# EAGLE design USBPOVToy.v1c (EAGLE 5.07)
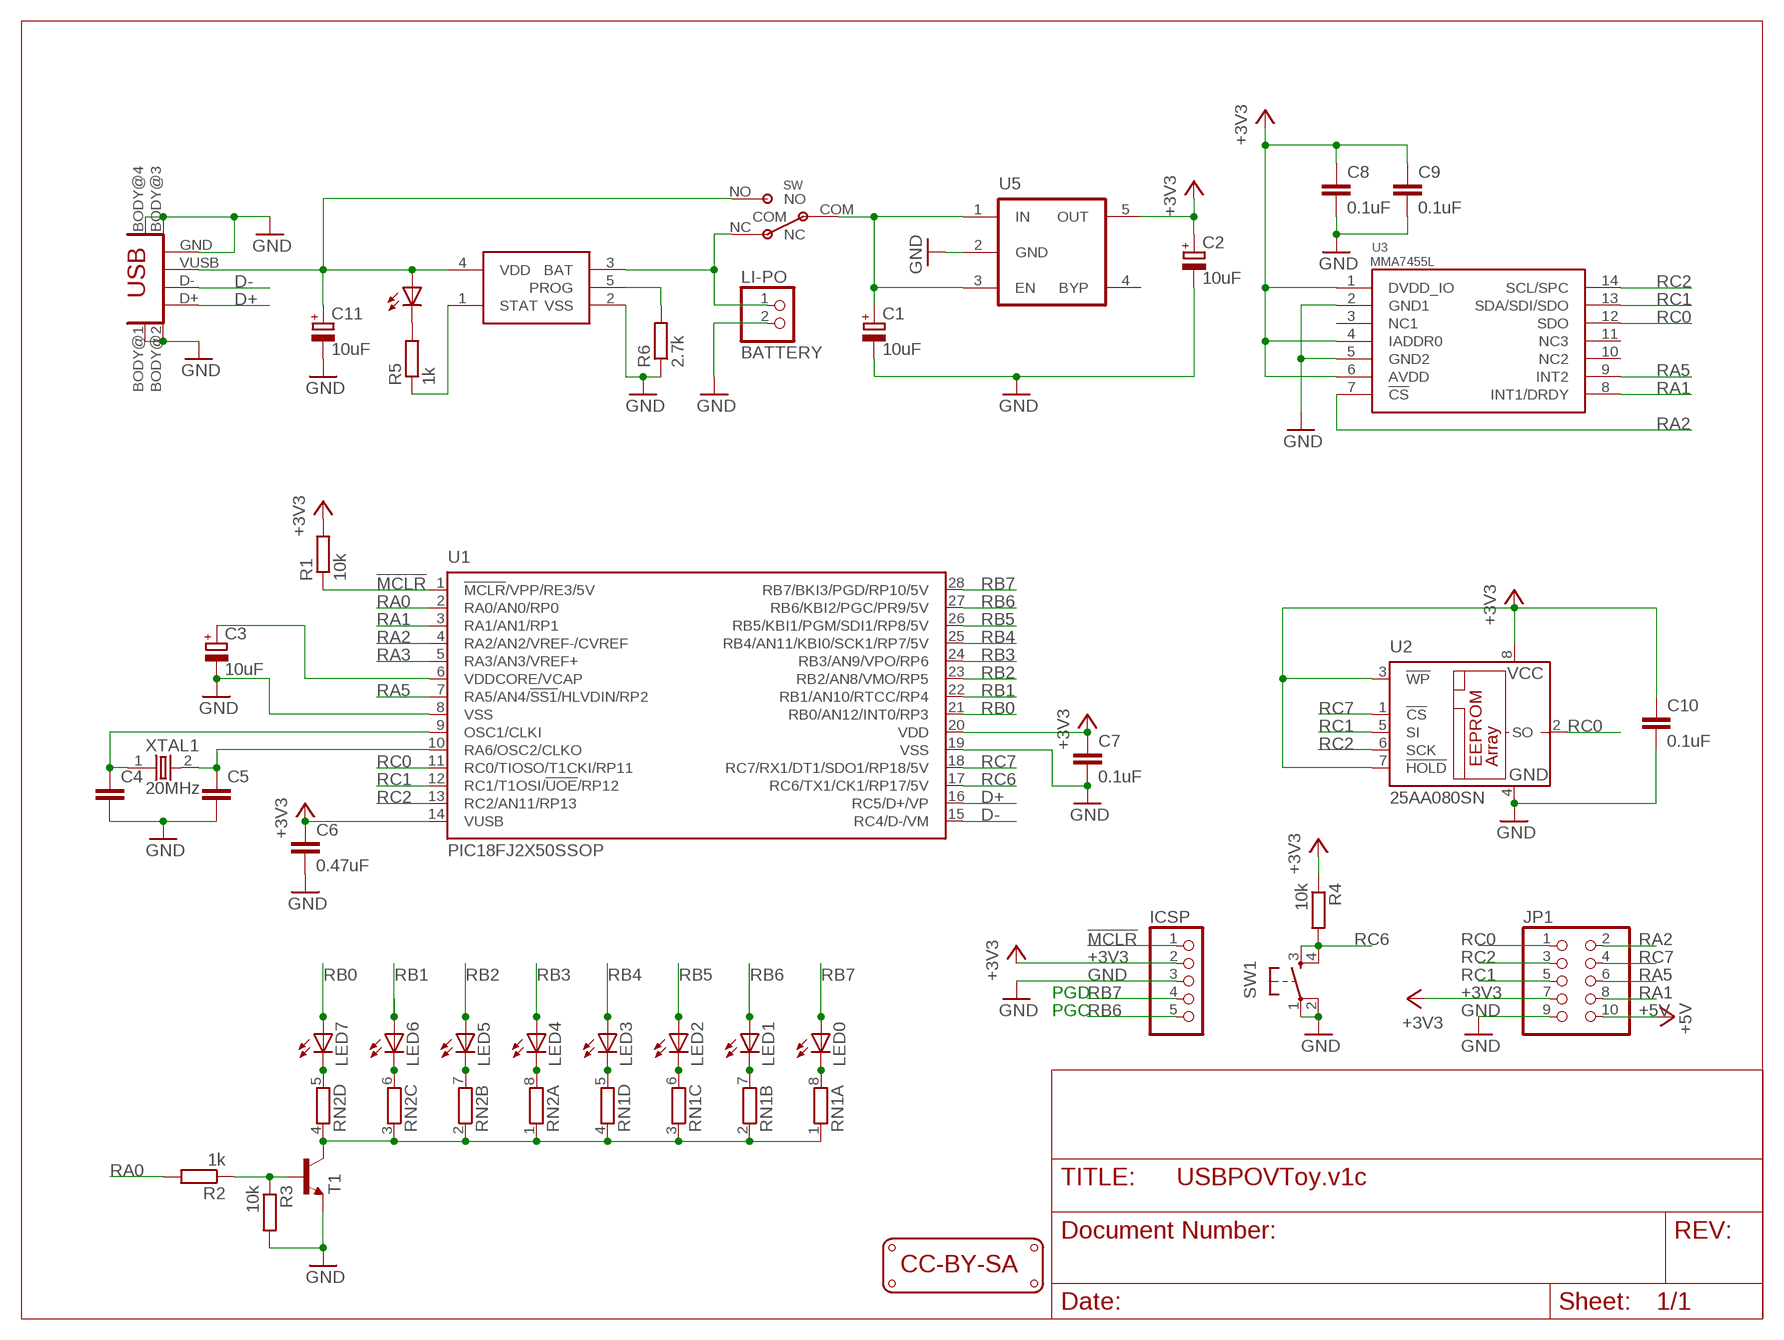
[diagram p0: schematic, sheet 1]

## Parts
C1  10uF  CAP_POLSMC_A  [SMC_A]
C2  10uF  CAP_POLSMC_A  [SMC_A]
C3  10uF  CAP_POLSMC_A  [SMC_A]
C4  CAPC603  [C603]
C5  CAPC603  [C603]
C6  0.47uF  CAPC603  [C603]
C7  0.1uF  CAPC603  [C603]
C8  0.1uF  CAPC603  [C603]
C9  0.1uF  CAPC603  [C603]
C10  0.1uF  CAPC603  [C603]
C11  10uF  CAP_POLSMC_A  [SMC_A]
CHRG  LED805  [LED-805]
ICSP  PINHD-1X5  [1X05]
JP1  PINHD-2X5  [2X05]
LED0  LED3MM  [LED-3MM]
LED1  LED3MM  [LED-3MM]
LED2  LED3MM  [LED-3MM]
LED3  LED3MM  [LED-3MM]
LED4  LED3MM  [LED-3MM]
LED5  LED3MM  [LED-3MM]
LED6  LED3MM  [LED-3MM]
LED7  LED3MM  [LED-3MM]
LED8  LED805  [LED-805]
LED9  LED805  [LED-805]
LED10  LED805  [LED-805]
LED11  LED805  [LED-805]
LED12  LED805  [LED-805]
LED13  LED805  [LED-805]
LED14  LED805  [LED-805]
LED15  LED805  [LED-805]
LI-PO  BATTERY  PINHD-1X2  [1X02]
LOGO1  LOGO_CC-BY-SA  [CC-BY-SA]
R1  10k  RESISTORR603  [R603]
R2  1k  RESISTORR603  [R603]
R3  10k  RESISTORR603  [R603]
R4  10k  RESISTORR603  [R603]
R5  1k  RESISTORR603  [R603]
R6  2.7k  RESISTORR603  [R603]
RN1  RNETWORK  [RN8P-4R-CRA06S]
RN2  RNETWORK  [RN8P-4R-CRA06S]
SW  SLIDE_SWITCH_SMD  [SLIDE_SWITCH_SMD]
SW1  SMD_TACT_SMALL  [TACT_SWITCH_SMALL]
T1  NPNSOT23BEC  [SOT23-BEC]
U1  PIC18FJ2X50SSOP  [SSOP28]
U2  25AA080SN  [SO-08]
U3  MMA7455L  [LGA-14]
U4  MCP73831  [SOT-23-5]
U5  MIC5205  [SOT-23-5]
USB  CONN_USB  [CONN_USB_MINI-B]
XTAL1  20MHz  CRYSTAL  [HC-49U]

## Nets
!MCLR: ICSP.1 R1.1 U1.1(!MCLR!/VPP/RE3/5V)
+3V3: C2.+ C6.1 C7.1 C8.1 C9.1 C10.1 ICSP.2 JP1.7 R1.2 R4.1 U1.14(VUSB) U1.20(VDD) U2.3(!WP) U2.7(!HOLD) U2.8(VCC) U3.1(DVDD_IO) U3.4(IADDR0) U3.6(AVDD) U5.5(OUT)
+5V: JP1.10
D+: U1.16(RC5/D+/VP) USB.D+
D-: U1.15(RC4/D-/VM) USB.D-
GND: C1.- C2.- C3.- C4.2 C5.2 C6.2 C7.2 C8.2 C9.2 C10.2 C11.- ICSP.3 JP1.9 LI-PO.2 R3.2 R6.1 SW1.1 SW1.2 T1.E U1.8(VSS) U1.19(VSS) U2.4(GND) U3.2(GND1) U3.5(GND2) U4.2(VSS) U5.2(GND) USB.BODY@1(BODY) USB.BODY@2(BODY) USB.BODY@3(BODY) USB.BODY@4(BODY) USB.GND
N$1: C4.1 U1.9(OSC1/CLKI) XTAL1.1
N$2: LED0.K(C) LED15.C RN1.8
N$3: LED1.K(C) LED14.C RN1.7
N$4: LED2.K(C) LED13.C RN1.6
N$5: LED3.K(C) LED12.C RN1.5
N$6: LED4.K(C) LED11.C RN2.8
N$7: LED5.K(C) LED10.C RN2.7
N$8: LED6.K(C) LED9.C RN2.6
N$9: LED7.K(C) LED8.C RN2.5
N$10: C3.+ U1.6(VDDCORE/VCAP)
N$11: C11.+ CHRG.A SW.NO U4.4(VDD) USB.VUSB
N$12: C5.1 U1.10(RA6/OSC2/CLKO) XTAL1.2
N$13: CHRG.C R5.2
N$14: R5.1 U4.1(STAT)
N$15: R6.2 U4.5(PROG)
N$16: LI-PO.1 SW.NC U4.3(BAT)
N$17: RN1.1 RN1.2 RN1.3 RN1.4 RN2.1 RN2.2 RN2.3 RN2.4 T1.C
N$18: R2.1 R3.1 T1.B
N$19: C1.+ SW.COM U5.1(IN) U5.3(EN)
RA0: R2.2 U1.2(RA0/AN0/RP0)
RA1: JP1.8 U1.3(RA1/AN1/RP1) U3.8(INT1/DRDY)
RA2: JP1.2 U1.4(RA2/AN2/VREF-/CVREF) U3.7(!CS)
RA3: U1.5(RA3/AN3/VREF+)
RA5: JP1.6 U1.7(RA5/AN4/!SS1!/HLVDIN/RP2) U3.9(INT2)
RB0: LED7.A LED8.A U1.21(RB0/AN12/INT0/RP3)
RB1: LED6.A LED9.A U1.22(RB1/AN10/RTCC/RP4)
RB2: LED5.A LED10.A U1.23(RB2/AN8/VMO/RP5)
RB3: LED4.A LED11.A U1.24(RB3/AN9/VPO/RP6)
RB4: LED3.A LED12.A U1.25(RB4/AN11/KBI0/SCK1/RP7/5V)
RB5: LED2.A LED13.A U1.26(RB5/KBI1/PGM/SDI1/RP8/5V)
RB6: ICSP.5 LED1.A LED14.A U1.27(RB6/KBI2/PGC/PR9/5V)
RB7: ICSP.4 LED0.A LED15.A U1.28(RB7/BKI3/PGD/RP10/5V)
RC0: JP1.1 U1.11(RC0/TIOSO/T1CKI/RP11) U2.2(SO) U3.12(SDO)
RC1: JP1.5 U1.12(RC1/T1OSI/!UOE!/RP12) U2.5(SI) U3.13(SDA/SDI/SDO)
RC2: JP1.3 U1.13(RC2/AN11/RP13) U2.6(SCK) U3.14(SCL/SPC)
RC6: R4.2 SW1.3 SW1.4 U1.17(RC6/TX1/CK1/RP17/5V)
RC7: JP1.4 U1.18(RC7/RX1/DT1/SDO1/RP18/5V) U2.1(!CS)
Unconnected: U3.3(NC1) U3.10(NC2) U3.11(NC3) U5.4(BYP)

## Notes on the sheet
- PGD
- PGC

## Library data of the parts
C1-C3 C11 = dp_devices:CAP_POL
C4-C10 = dp_devices:CAP
CHRG LED0 LED1-LED15 = dp_devices:LED
ICSP = pinhead - Copy:PINHD-1X5: PIN HEADER
JP1 = pinhead:PINHD-2X5: PIN HEADER
LI-PO = pinhead:PINHD-1X2: PIN HEADER
LOGO1 = dp_devices:LOGO_CC-BY-SA
R1-R6 = dp_devices:RESISTOR
RN1 RN2 = dp_devices:RNETWORK: 4 Resistor Array 0603
SW = dp_devices:SLIDE_SWITCH_SMD
SW1 = dp_devices:SMD_TACT_SMALL
T1 = dp_devices:NPN: Most commonly used is SOT23-BEC
U1 = dp_devices:PIC18FJ2X50; PIC18FJ2X50: PIC18FJ2X50
U2 = microchip:25*: Serial EEPROM 4K/ 8K , SPI bus
U3 = jer_eagle:MMA7455L
U4 = dp_devices:MCP73831
U5 = dp_devices:MIC5205: 150ma Low-Noise LDO Regulator
USB = dp_devices:CONN_USB: USB connector
XTAL1 = dp_devices:CRYSTAL

## Board
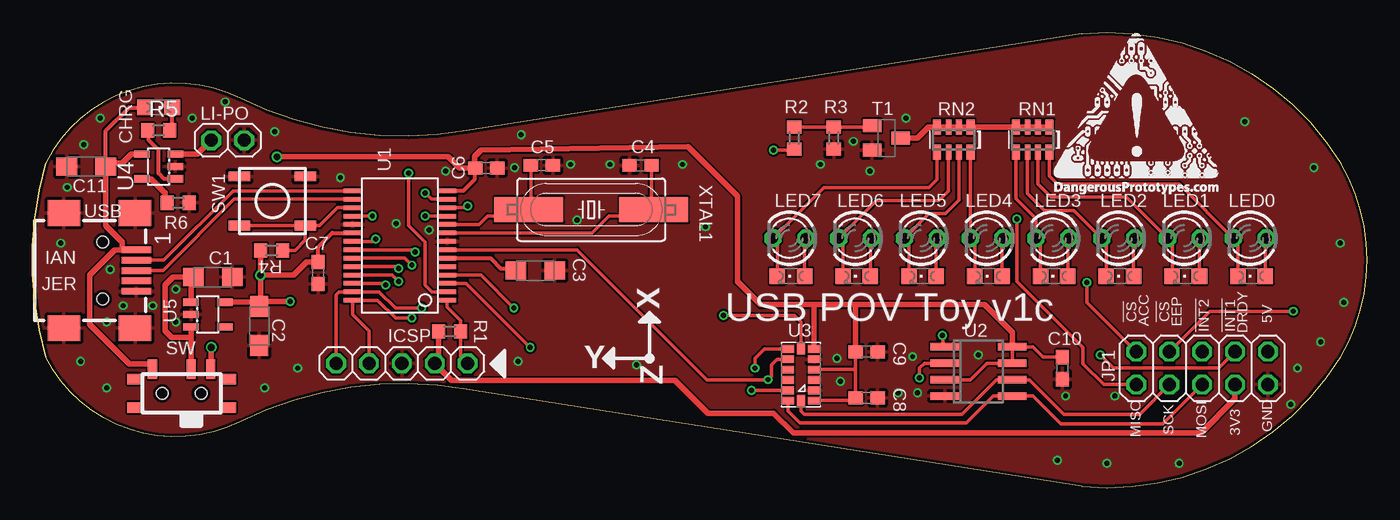
[diagram p1: board, top side]
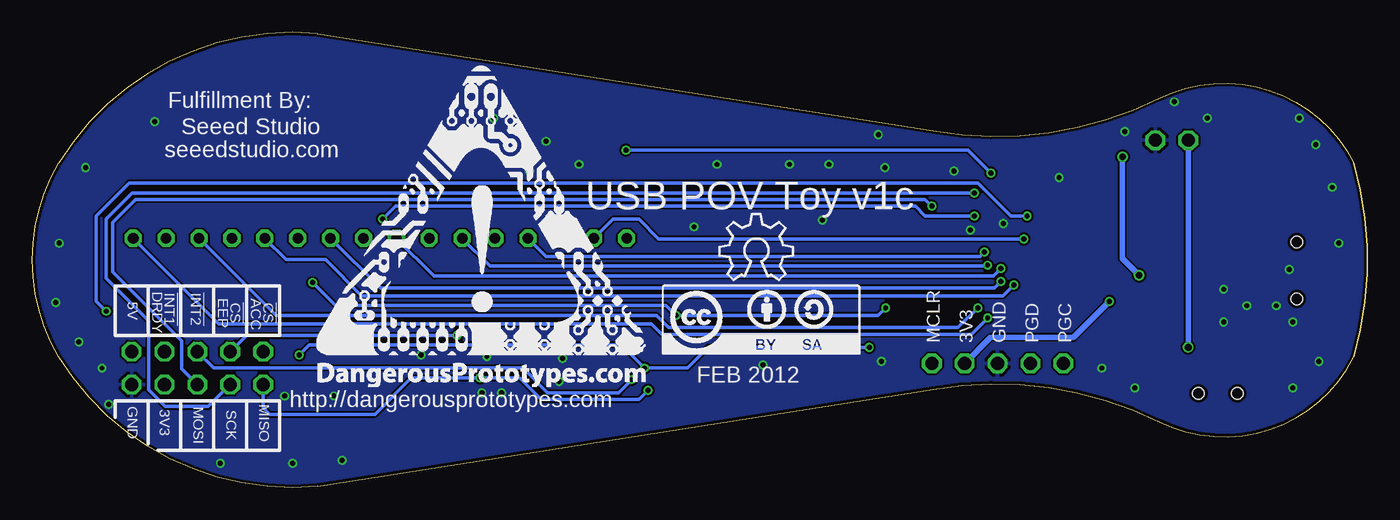
[diagram p2: board, bottom side, seen from below]

Size 103.07 x 35.18 mm. Coordinates in mm from the lower left corner, seen from the top.
Outline: 1.03,25.09 arc32 1.03,10.09
Outline: 1.03,10.09 arc-32 1.03,25.09
Outline: 1.03,25.09 arc-89 16.03,30.09 arc36 33.53,27.59 81.03,35.09 arc-64 101.03,25.09 arc-61 101.03,10.09 arc-64 81.03,0.09 33.53,7.59 arc36 16.03,5.09 arc-89 1.03,10.09
Outline: 1.03,25.09 arc32 1.03,10.09
Copper layers (1*16): Top 0.035mm / dielectric 1.5mm / Bottom 0.035mm
Design rules "Fusion_eagle_rule_v1.1": minimum track width 6mil, minimum drill 12mil, track to track 6mil, track to pad 6mil, pad to pad 6mil, via to via 6mil, smd to smd 0mil, copper to edge 10mil, drill to drill 10mil, minimum pad ring 10mil, minimum via ring 6mil, stop-mask expansion 2mil, vias tented up to drill 100mil, thermal gap 10mil

### Footprints (pad centres in the part's own frame; a part is rotated, then mirrored left to right if it is on the bottom)
SMC_A = smd 1.6 x 1.4: + -1.5,0; - 1.5,0
C603 = smd 1.1 x 1: 1 -0.85,0; 2 0.85,0
LED-805 = smd 1.2 x 1.2: A 0,-1.05; C 0,1.05
1X05 = drill 1.016 octagon: 1 -5.08,0; 2 -2.54,0; 3 0,0; 4 2.54,0; 5 5.08,0
2X05 = drill 1.016 octagon: 1 -5.08,-1.27; 2 -5.08,1.27; 3 -2.54,-1.27; 4 -2.54,1.27; 5 0,-1.27; 6 0,1.27; 7 2.54,-1.27; 8 2.54,1.27; 9 5.08,-1.27; 10 5.08,1.27
LED-3MM = drill 0.813 octagon: A -1.27,0; K 1.27,0
1X02 = drill 1.016 octagon: 1 -1.27,0; 2 1.27,0
R603 = smd 1 x 1.1: 1 -0.85,0; 2 0.85,0
RN8P-4R-CRA06S = smd 0.63 x 1.15: 1 -1.295,-0.975; 4 1.295,-0.975; 5 1.295,0.975; 8 -1.295,0.975 | smd 0.44 x 1.15: 2 -0.4,-0.975; 3 0.4,-0.975; 6 0.4,0.975; 7 -0.4,0.975
SLIDE_SWITCH_SMD = smd 0.7 x 1.5: COM 0.75,1.875; NC 2.25,1.875; NO -2.25,1.875 | smd 1 x 0.8: P$1 -3.7,-1.1; P$2 -3.7,1.1; P$3 3.7,1.1; P$4 3.7,-1.1 | hole 0.9: -1.5,0; 1.5,0
TACT_SWITCH_SMALL = smd 1.651 x 0.762: 1 -2.54,1.905; 2 2.54,1.905; 3 -2.54,-1.905; 4 2.54,-1.905
SOT23-BEC = smd 1 x 1.4: B -0.95,-1.1; C 0,1.1; E 0.95,-1.1
SSOP28 = smd 0.348 x 1.397: 1 -4.225,-3.656; 2 -3.575,-3.656; 3 -2.925,-3.656; 4 -2.275,-3.656; 5 -1.625,-3.656; 6 -0.975,-3.656; 7 -0.325,-3.656; 8 0.325,-3.656; 9 0.975,-3.656; 10 1.625,-3.656; 11 2.275,-3.656; 12 2.925,-3.656; 13 3.575,-3.656; 14 4.225,-3.656; 15 4.225,3.656; 16 3.575,3.656; 17 2.925,3.656; 18 2.275,3.656; 19 1.625,3.656; 20 0.975,3.656; 21 0.325,3.656; 22 -0.325,3.656; 23 -0.975,3.656; 24 -1.625,3.656; 25 -2.275,3.656; 26 -2.925,3.656; 27 -3.575,3.656; 28 -4.225,3.656
SO-08 = smd 0.6 x 2.2: 1 -1.905,-2.6; 2 -0.635,-2.6; 3 0.635,-2.6; 4 1.905,-2.6; 5 1.905,2.6; 6 0.635,2.6; 7 -0.635,2.6; 8 -1.905,2.6
LGA-14 = smd 0.6 x 0.9: 1 -2,-1; 2 -1.2,-1; 3 -0.4,-1; 4 0.4,-1; 5 1.2,-1; 6 2,-1; 8 2,1; 9 1.2,1; 10 0.4,1; 11 -0.4,1; 12 -1.2,1; 13 -2,1 | smd 0.9 x 0.6: 7 2,0; 14 -2,0
SOT-23-5 = smd 0.55 x 1.2: 1 -0.95,-1.3; 2 0,-1.3; 3 0.95,-1.3; 4 0.95,1.3; 5 -0.95,1.3
CONN_USB_MINI-B = smd 2 x 2.5: BODY@1 -4.45,2.5; BODY@2 4.45,2.5; BODY@3 4.45,-3; BODY@4 -4.45,-3 | smd 0.5 x 2.3: D+ 0,2.6; D- -0.8,2.6; GND 1.6,2.6; P4 0.8,2.6; VUSB -1.6,2.6 | hole 0.9: -2.2,0; 2.2,0
HC-49U = smd 5.334 x 1.93: 1 -4.826,0; 2 4.826,0

### Placement (x,y rotation side)
C1  13.94,16.26 0 top
C2  17.52,12.49 270 top
C3  38.83,16.77 0 top
C4  27pF  [C603]  46.96,24.9 180 top
C5  27pF  [C603]  39.34,24.9 0 top
C6  35.05,24.69 0 top
C7  22.06,16.58 270 top
C8  64.42,6.95 0 top
C9  64.42,10.5 0 top
C10  79.54,9.23 270 top
C11  4.16,24.81 180 top
CHRG  9.74,29.38 270 top
ICSP  28.53,9.6 180 top
JP1  90.33,9.23 0 top
LED0  94.01,19.27 180 top
LED1  88.93,19.27 180 top
LED2  83.85,19.27 180 top
LED3  78.77,19.27 180 top
LED4  73.69,19.27 180 top
LED5  68.61,19.27 180 top
LED6  63.53,19.27 180 top
LED7  58.45,19.27 180 top
LED8  58.58,16.34 90 top
LED9  63.66,16.34 90 top
LED10  68.74,16.34 90 top
LED11  73.82,16.34 90 top
LED12  78.9,16.34 90 top
LED13  83.98,16.34 90 top
LED14  89.06,16.34 90 top
LED15  94.14,16.34 90 top
LI-PO  15.08,26.84 0 top
LOGO1  54.45,10.33 0 bottom
R1  32.23,12.07 180 top
R2  58.83,27.01 270 top
R3  61.88,27.01 270 top
R4  18.47,18.32 0 top
R5  9.74,27.6 0 top
R6  11.27,22.01 180 top
RN1  1K  [RN8P-4R-CRA06S]  77.25,26.89 180 top
RN2  1K  [RN8P-4R-CRA06S]  71.15,26.89 180 top
SW  11.52,7.28 0 top
SW1  18.54,22.15 0 top
T1  BC81840MTF  [SOT23-BEC]  65.95,27.01 270 top
U1  28.38,18.7 90 top
U2  73.06,8.98 270 top
U3  59.34,8.72 90 top
U4  9.74,24.81 90 top
U5  MIC5205-3.3BM5  [SOT-23-5]  13.55,13.38 270 top
U$1  [OSHW_8X200_NOTEXT]  50,16.04 0 bottom
U$2  [DP_LOGO_ART_1X1]  81.12,7.79 0 bottom
U$3  [DP_LOGO_ART_0.5X0.5]  78.9,22.71 0 top
USB  5.43,16.77 270 top
XTAL1  43.15,21.47 180 top

### Tracks (layer width: path | path; a pad name or v marks a point on that pad's centre or on a via)
!MCLR
  Top 0.254: ICSP.1 33.08,10.13 R1.1 33.08,12.9 32.04,13.94 U1.1
+3V3  (via drill 0.38, 0.51)
  Top 0.254: C10.1 78.05,10.08 77.25,10.88 U2.8 U2.7 73.69,9.61 72.42,8.34 U2.3 | C9.1 63.57,8.98 | 63.57,8.98 C8.1 63.35,6.72 U3.1 | U3.4 63.43,9.12 63.57,8.98
  Top 0.305: U1.20 23.16,19.68 22.06,18.58 C7.1 | U1.14 33.27,22.93 34.13,23.79 34.13,24.61 C6.1
  Top 0.406: JP1.7 92.87,6.84 90.26,4.23 58.77,4.23 57.24,5.76 52.16,5.76 49.62,8.3 32.38,8.3 ICSP.2 | U2.8 75.66,11.98 73.5,14.14 63.59,14.14 | 60.29,14.14 56.23,14.14 54.45,15.92 54.45,22.52 50.64,26.33 34.64,26.08 34.13,25.57 34.13,24.76 C6.1 32.98,24.69 32.1,25.57 v18.89,25.57 | 60.29,14.14 63.59,14.14 | C9.1 63.57,14.12 63.59,14.14 | U3.6 60.34,14.09 60.29,14.14 | 17.62,14.14 17.62,14.09 C2.+ | U5.5 17.19,14.33 C2.+ | C7.1 21.17,17.43 20.16,16.42 v17.62,16.42 | v17.62,16.42 R4.1 | v17.62,16.42 17.62,14.09 C2.+ | ICSP.2 31.05,9.6 | v19.9,14.39 17.92,14.39 C2.+ | R1.2 31.38,9.91 ICSP.2
  Bottom 0.406: v18.89,25.57 18.89,17.69 v17.62,16.42 | v19.9,14.39 22.7,11.6 29.07,11.6 ICSP.2
D+
  Top 0.254: USB.D+ 10.09,16.77 15.6,22.28 U1.16
D-
  Top 0.254: USB.D- 10.13,17.57 15.49,22.93 U1.15
GND  (via drill 0.38)
  other vias: 62.14,9.99 62.39,8.22 67.98,10.12 97.19,6.44 79.79,7.07 83.6,7.07 66.84,7.33 68.36,7.33 93.63,28.28 67.47,28.54 51.98,20.15 37.5,9.74 46.64,9.49 28.1,20.41 30.64,19.9 31.91,24.47 23.78,23.96 18.7,27.52 37.75,27.27 11.08,15.33 11.08,12.79 9.3,14.06 6,16.85 5.75,12.79 7.02,14.06 12.35,28.54 14.89,29.81 3.97,26.5 5.24,28.54 2.7,23.2 2.19,18.88 3.72,9.74 5.75,7.71 17.94,7.71 20.48,9.23 42.07,20.66 41.56,24.98 44.61,24.98 50.2,24.98 37.24,24.73 64.68,24.47 60.87,24.98 63.41,26.76 73.06,10.25 97.7,9.23 99.47,11.26 101.25,14.31 88.55,1.87 82.96,1.87 79.15,2.12 101,18.88 98.97,24.73
  pour Top: -3.97,35.09 106.03,35.09 106.03,-4.91 -3.97,-4.91
  pour Bottom: -3.97,35.09 106.03,35.09 106.03,-4.91 -3.97,-4.91
N$1
  Top 0.254: C4.1 47.81,21.13 XTAL1.1 47.5,21 44.54,21 43.22,19.68 U1.9
N$2
  Top 0.254: LED15.C 93.09,18.92 LED0.K 88.55,23.46 79.15,23.46 78.54,24.07 RN1.8
N$3
  Top 0.254: LED14.C 88.01,18.92 LED1.K 84.49,22.44 78.65,22.44 77.65,23.44 RN1.7
N$4
  Top 0.254: LED13.C 82.93,18.92 LED2.K 80.42,21.42 78.14,21.42 76.85,22.71 RN1.6
N$5
  Top 0.254: LED12.C 77.85,18.92 LED3.K 77.5,20.79 75.95,22.34 RN1.5
N$6
  Top 0.254: LED11.C 72.77,18.92 LED4.K 72.45,19.29 RN2.8
N$7
  Top 0.254: LED10.C 67.69,18.92 LED5.K 69.25,21.17 70.52,21.17 71.55,22.21 RN2.7
N$8
  Top 0.254: LED9.C 62.61,18.92 LED6.K 65.18,22.19 70.01,22.19 70.75,22.93 RN2.6
N$9
  Top 0.254: LED8.C 57.53,18.92 LED7.K 61.12,23.2 69.25,23.2 69.86,23.81 RN2.5
N$10
  Top 0.305: U1.6 35.36,17.73 36.16,16.93 37.17,16.93 C3.+
N$11
  Top 0.305: 5.68,24.78 C11.+ 5.68,24.83 5.68,27.6 7.46,29.38 CHRG.A
  Top 0.406: U4.4 7.65,25.76 6.95,25.06 5.91,25.06 C11.+ 5.66,20.26 6.95,18.96 6.95,18.37 | 6.95,18.37 6.36,18.37 4.41,16.42 4.41,12.61 7.46,9.57 9.24,9.57 9.27,9.53 SW.NO | 6.95,18.37 USB.VUSB
N$12
  Top 0.254: C5.1 38.49,21.13 XTAL1.2 37.85,21 35.14,21 34.48,20.33 U1.10
N$13
  Top 0.305: CHRG.C 10.79,27.8 R5.2
N$14
  Top 0.305: U4.1 10.19,23.86 9.74,24.3 9.74,26.08 8.98,26.84 8.98,27.51 R5.1
N$15
  Top 0.406: U4.5 9.17,23.86 10.25,22.77 10.25,22.18 R6.2
N$16  (via drill 0.51)
  Top 0.406: U4.3 12.73,25.76 LI-PO.1 | SW.NC 13.77,9.53 13.81,9.57 v13.81,10.84
  Bottom 0.406: v13.81,10.84 LI-PO.1
N$17
  Top 0.406: RN1.1 RN1.2 RN1.3 RN1.4 RN2.1 RN2.2 RN2.3 RN2.4 69.19,27.86 68.34,27.01 T1.C
N$18
  Top 0.254: R2.1 R3.1 64.75,27.86 T1.B
N$19
  Top 0.406: SW.COM 12.27,11.6 | 12.27,11.6 12.27,12.41 U5.3 | U5.1 12.25,16.2 C1.+ 10.85,16.26 10.25,15.66 10.25,12.11 10.76,11.6 12.27,11.6
RA0  (via drill 0.38)
  Top 0.254: v29.05,24.3 29.05,20.23 30.32,18.96 30.32,15.66 30.85,15.13 U1.2 | v57.24,26.08 58.75,26.08 R2.2
  Bottom 0.254: v29.05,24.3 30.83,26.08 v57.24,26.08
RA1  (via drill 0.38)
  Top 0.254: JP1.8 91.6,9.23 83.47,9.23 v82.46,10.25 | U3.8 56.52,10.72 55.79,9.99 v55.79,9.23 | U1.3 33.5,15.78 v38.45,10.84
  Bottom 0.254: v82.46,10.25 81.69,11.01 57.56,11.01 v55.79,9.23 52.5,9.23 50.89,10.84 v38.45,10.84
RA2  (via drill 0.38)
  Top 0.254: v53.37,13.3 58.83,13.3 59.34,12.79 U3.7 | v81.44,15.84 81.44,14.31 JP1.2 | U1.4 34.64,16.42 v37.18,13.88
  Bottom 0.254: v81.44,15.84 79.66,14.06 54.14,14.06 v53.37,13.3 37.76,13.3 v37.18,13.88
RA5  (via drill 0.38)
  Top 0.254: U3.9 57.49,9.92 57.06,9.49 57.06,8.6 v56.8,8.34 52.1,8.34 42.07,18.38 U1.7
  Bottom 0.254: v56.8,8.34 57.82,7.33 63.28,7.33 65.18,9.23 89.06,9.23 JP1.6
RB0  (via drill 0.38)
  Top 0.254: LED8.A 59.63,19.17 LED7.A | U1.21 26.32,19.03 v26.51,19.22
  Bottom 0.254: v26.51,19.22 54.7,19.22 56.23,20.74 58.25,20.74 LED7.A
RB1  (via drill 0.38)
  Top 0.254: LED9.A 64.71,19.17 LED6.A | v29.56,18.2 29.38,18.38 U1.22
  Bottom 0.254: LED6.A 63.41,17.87 29.89,17.87 v29.56,18.2
RB2  (via drill 0.38)
  Top 0.254: LED10.A 69.79,19.17 LED5.A | v29.3,17.19 28.76,17.73 U1.23
  Bottom 0.254: LED5.A 67.72,17.11 29.38,17.11 v29.3,17.19
RB3  (via drill 0.38)
  Top 0.254: LED11.A 74.87,19.17 LED4.A | v28.29,16.93 28.14,17.08 U1.24
  Bottom 0.254: LED4.A 72.04,16.34 28.87,16.34 v28.29,16.93
RB4  (via drill 0.38)
  Top 0.254: LED12.A 79.95,19.17 LED3.A | v28.29,15.92 27.77,16.43 U1.25
  Bottom 0.254: LED3.A 76.19,15.41 28.79,15.41 v28.29,15.92
RB5  (via drill 0.38)
  Top 0.254: LED13.A 85.03,19.17 LED2.A | v27.27,15.66 27.15,15.78 U1.26
  Bottom 0.254: LED2.A 83.47,17.61 80.42,17.61 77.63,14.82 28.11,14.82 v27.27,15.66
RB6  (via drill 0.38)
  Top 0.254: LED14.A 90.11,19.17 LED1.A | ICSP.5 23.46,14.9 23.69,15.13 U1.27 26.79,15.13 28.03,13.88 v30.06,13.88
  Bottom 0.254: LED1.A 84.23,13.3 54.88,13.3 53.94,12.36 31.59,12.36 v30.06,13.88
RB7  (via drill 0.38)
  Top 0.254: LED15.A 95.19,19.17 LED0.A | ICSP.4 25.99,12.11 24.73,13.38 U1.28 26.68,14.48 28.03,13.12 v29.3,13.12
  Bottom 0.254: LED0.A 88.68,12.66 55.26,12.66 54.45,11.85 30.57,11.85 v29.3,13.12
RC0  (via drill 0.38)
  Top 0.254: v55.53,7.52 U3.12 | v68.49,8.47 68.49,9.23 68.87,9.61 U2.2 | U1.11 30.34,20.98 v30.32,21 | v76.04,20.74 76.04,15.92 81.12,10.84 81.12,9.57 82.72,7.96 JP1.1
  Bottom 0.254: v55.53,7.52 56.24,6.82 63.79,6.82 65.44,8.47 v68.49,8.47 73.82,8.47 76.61,5.68 84.74,5.68 85.25,6.18 JP1.1 | v30.32,21 34.13,21 34.89,21.76 75.02,21.76 v76.04,20.74
RC1  (via drill 0.38)
  Top 0.254: JP1.5 87.28,4.91 79.41,4.91 77.25,7.07 U2.5 74.2,7.07 72.12,4.99 59.27,4.99 58.34,5.93 U3.13 | U1.12 33.49,21.63 v33.62,21.76
  Bottom 0.254: v33.62,21.76 34.13,22.27 95.09,22.27 96.87,20.49 96.87,16.68 91.53,11.34 91.53,9.16 JP1.5
RC2  (via drill 0.38)
  Top 0.254: JP1.3 85.5,5.68 79.66,5.68 77,8.34 U2.6 74.46,8.34 71.79,5.68 59.61,5.68 59.34,5.94 U3.14 | U1.13 30.81,22.28 v30.32,22.77
  Bottom 0.254: v30.32,22.77 95.34,22.77 97.37,20.74 97.37,16.17 94.07,12.87 94.07,7.53 92.8,6.26 89.49,6.26 JP1.3
RC6
  Top 0.254: SW1.3 SW1.4 | SW1.4 22.2,20.24 23.58,21.63 U1.17 | R4.2 20.28,18.32 21.08,19.12 SW1.4
RC7  (via drill 0.38)
  Top 0.254: U2.1 70.44,10.88 70.32,11.01 70.32,11.72 v70.26,11.77 | U1.18 26.24,20.98 v26.25,21 | v97.37,13.63 90.92,13.63 JP1.4
  Bottom 0.254: JP1.4 86.52,11.77 v70.26,11.77 | v26.25,21 27.52,21 30.06,23.54 95.6,23.54 98.14,21 98.14,14.39 v97.37,13.63

### Text on the board
tNames: IAN | JER | X | USB POV Toy v1c | !CS | !CS | 5V | ACC | EEP | !INT2 | !INT1 | DRDY | Y | Z | MISO | SCK | MOSI | 3V3 | GND
bNames: Fulfillment By: | Seeed Studio | seeedstudio.com | USB POV Toy v1c | ACC | EEP | !INT2 | !INT1 | DRDY | !CS | !CS | 5V | PGC | PGD | GND | 3V3 | MCLR | FEB 2012 | http://dangerousprototypes.com | MISO | SCK | MOSI | 3V3 | GND